# Altium project CustomESP32.PrjPcb
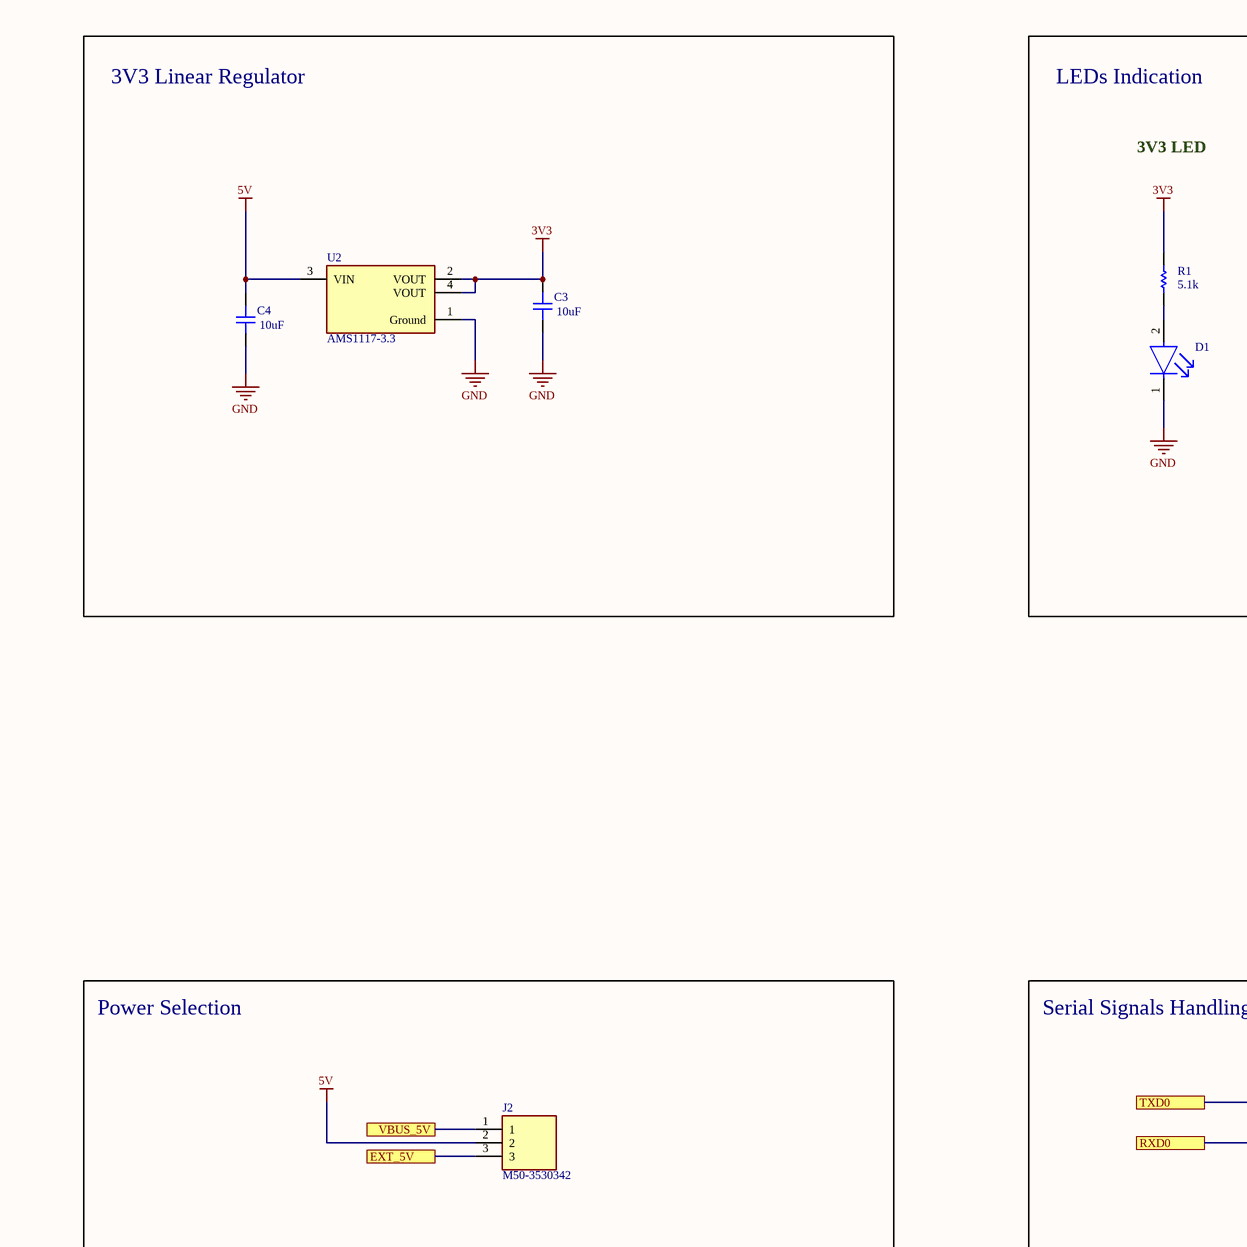
[diagram p0: CustomESP32.SchDoc, top left]
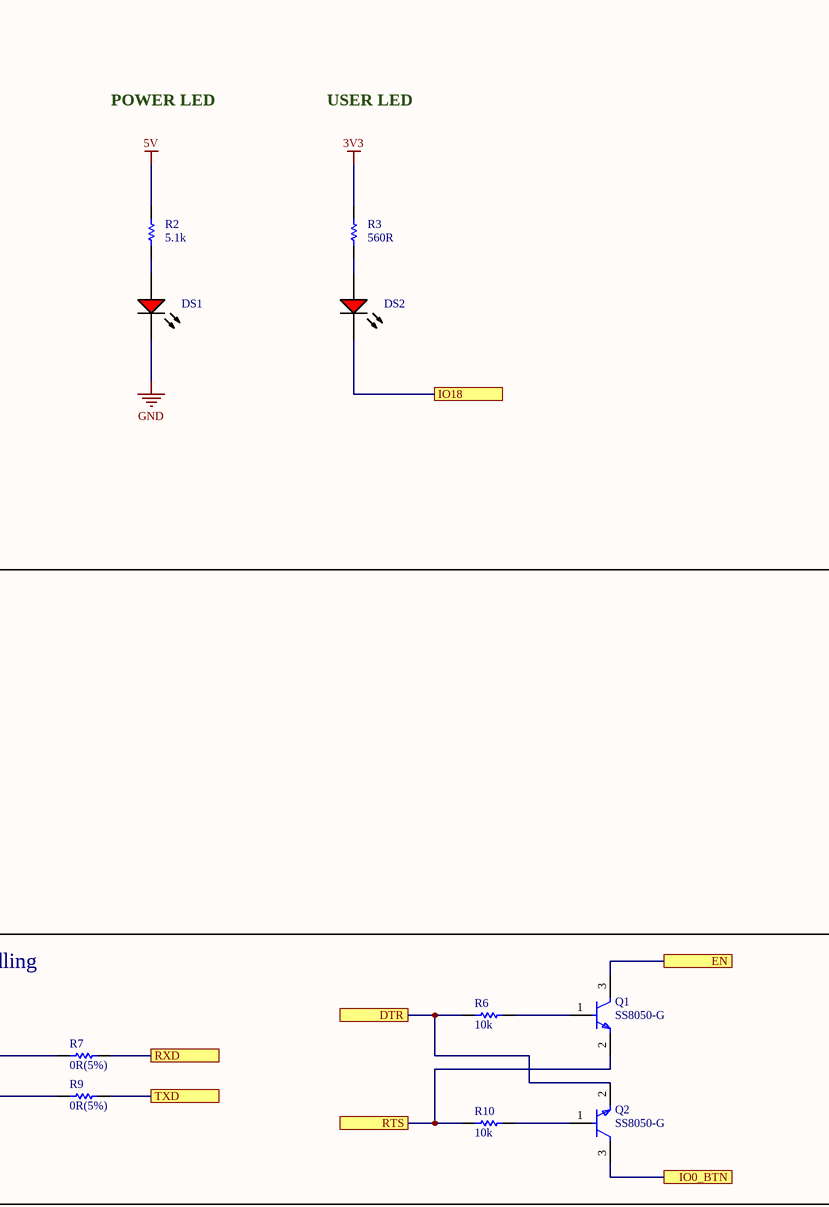
[diagram p1: CustomESP32.SchDoc, top middle]
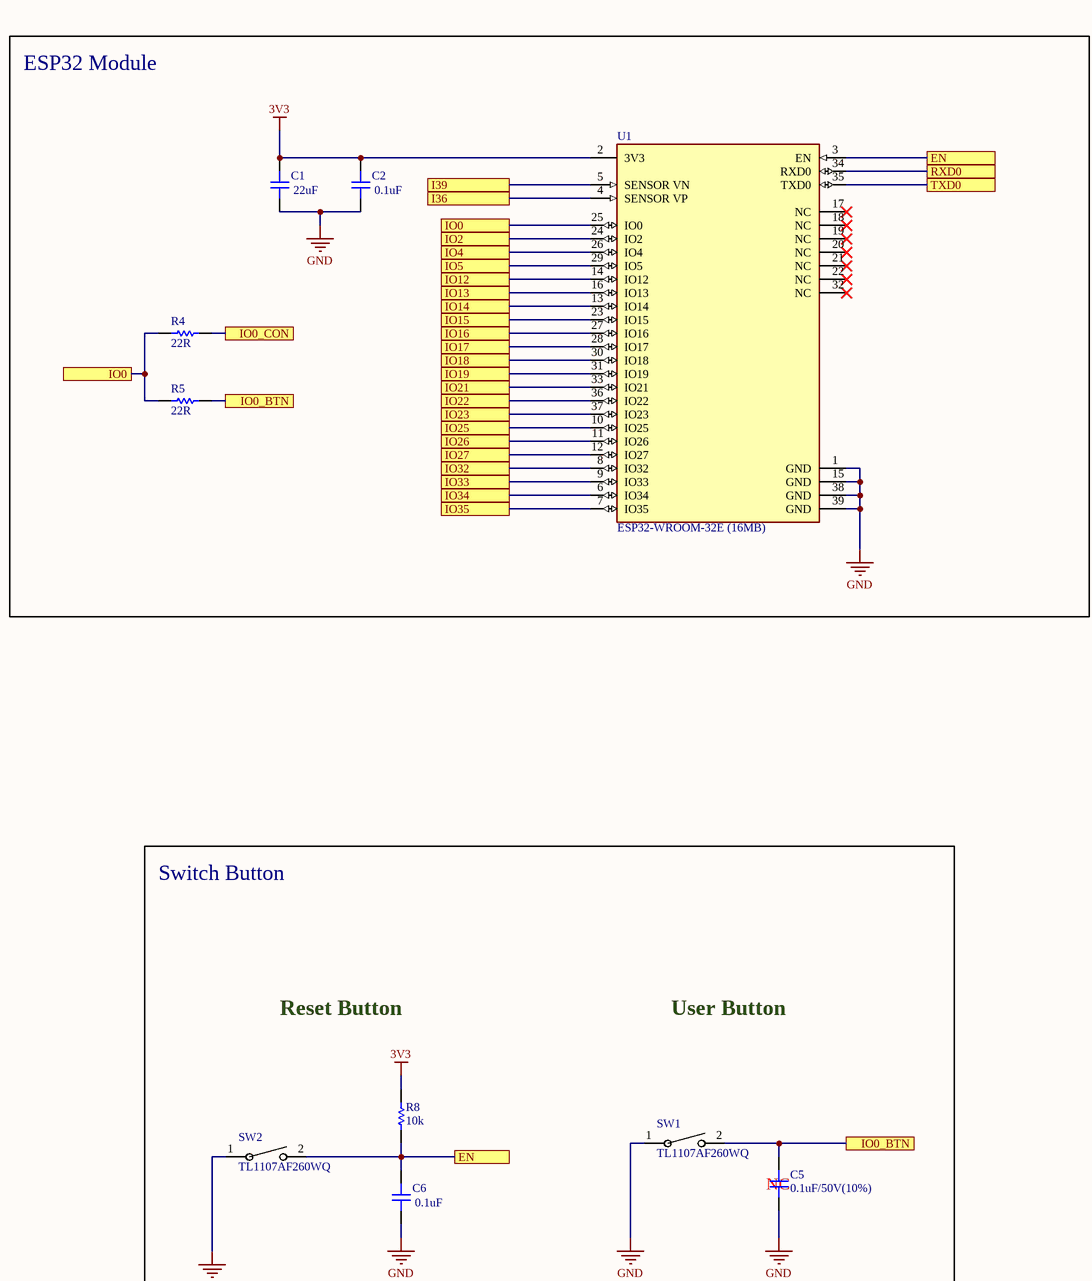
[diagram p2: CustomESP32.SchDoc, top right]
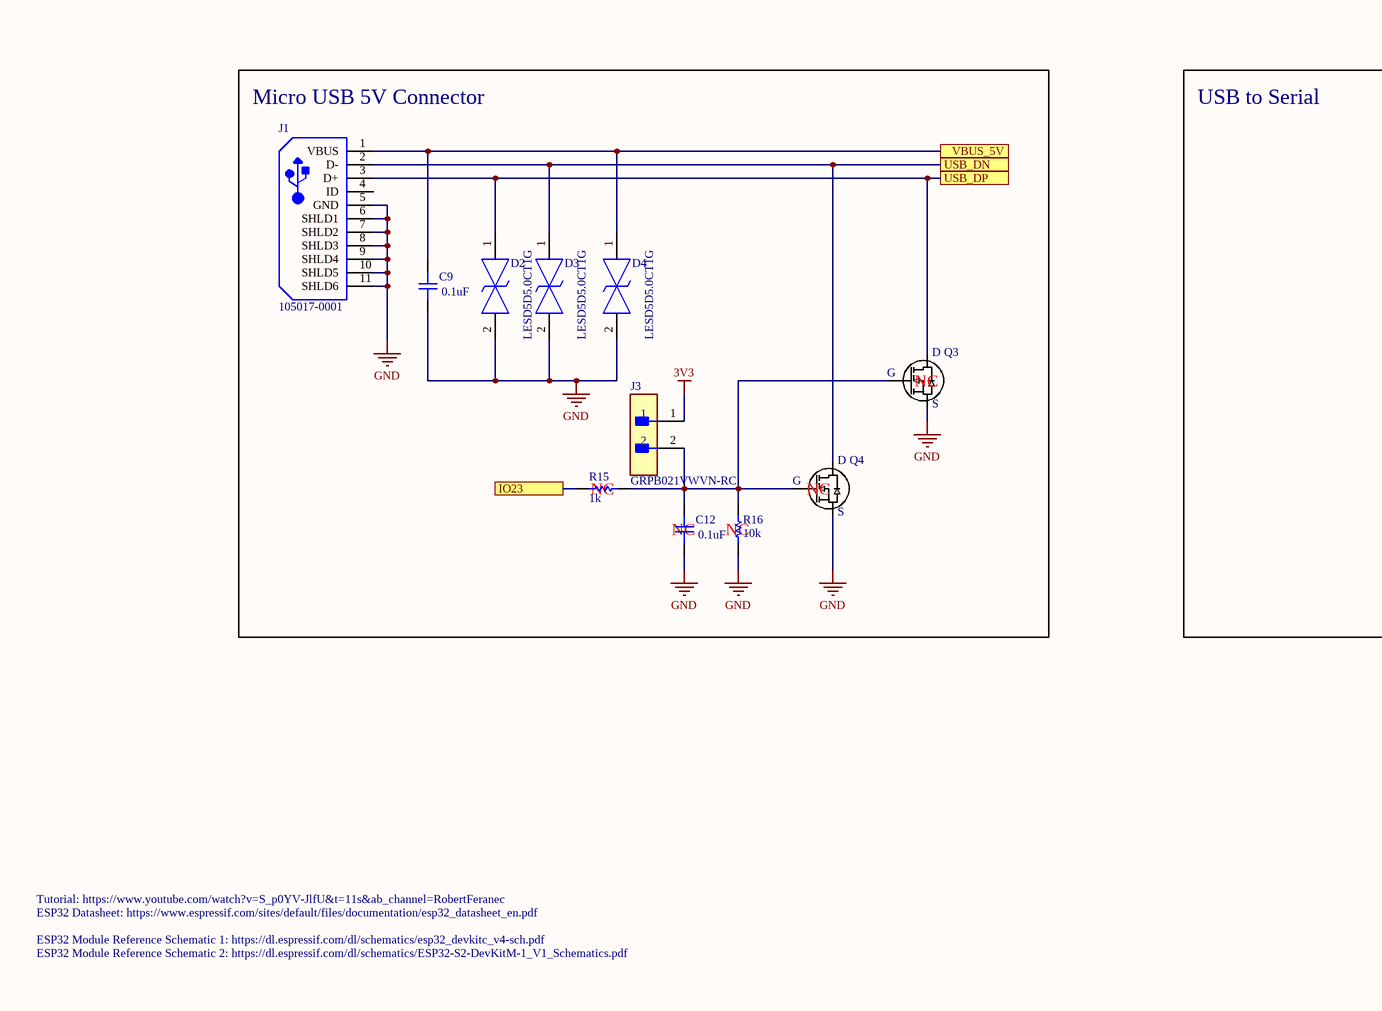
[diagram p3: CustomESP32.SchDoc, bottom left]
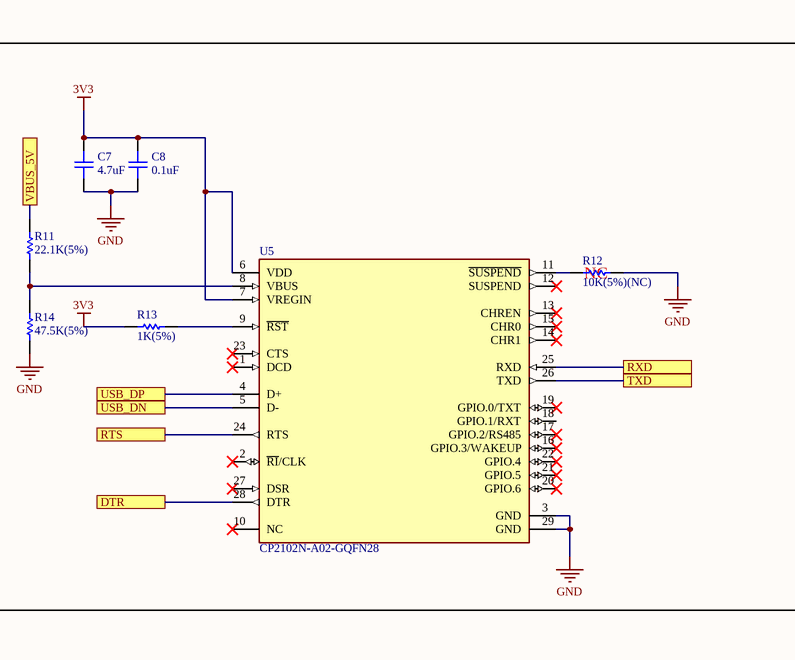
[diagram p4: CustomESP32.SchDoc, bottom middle]
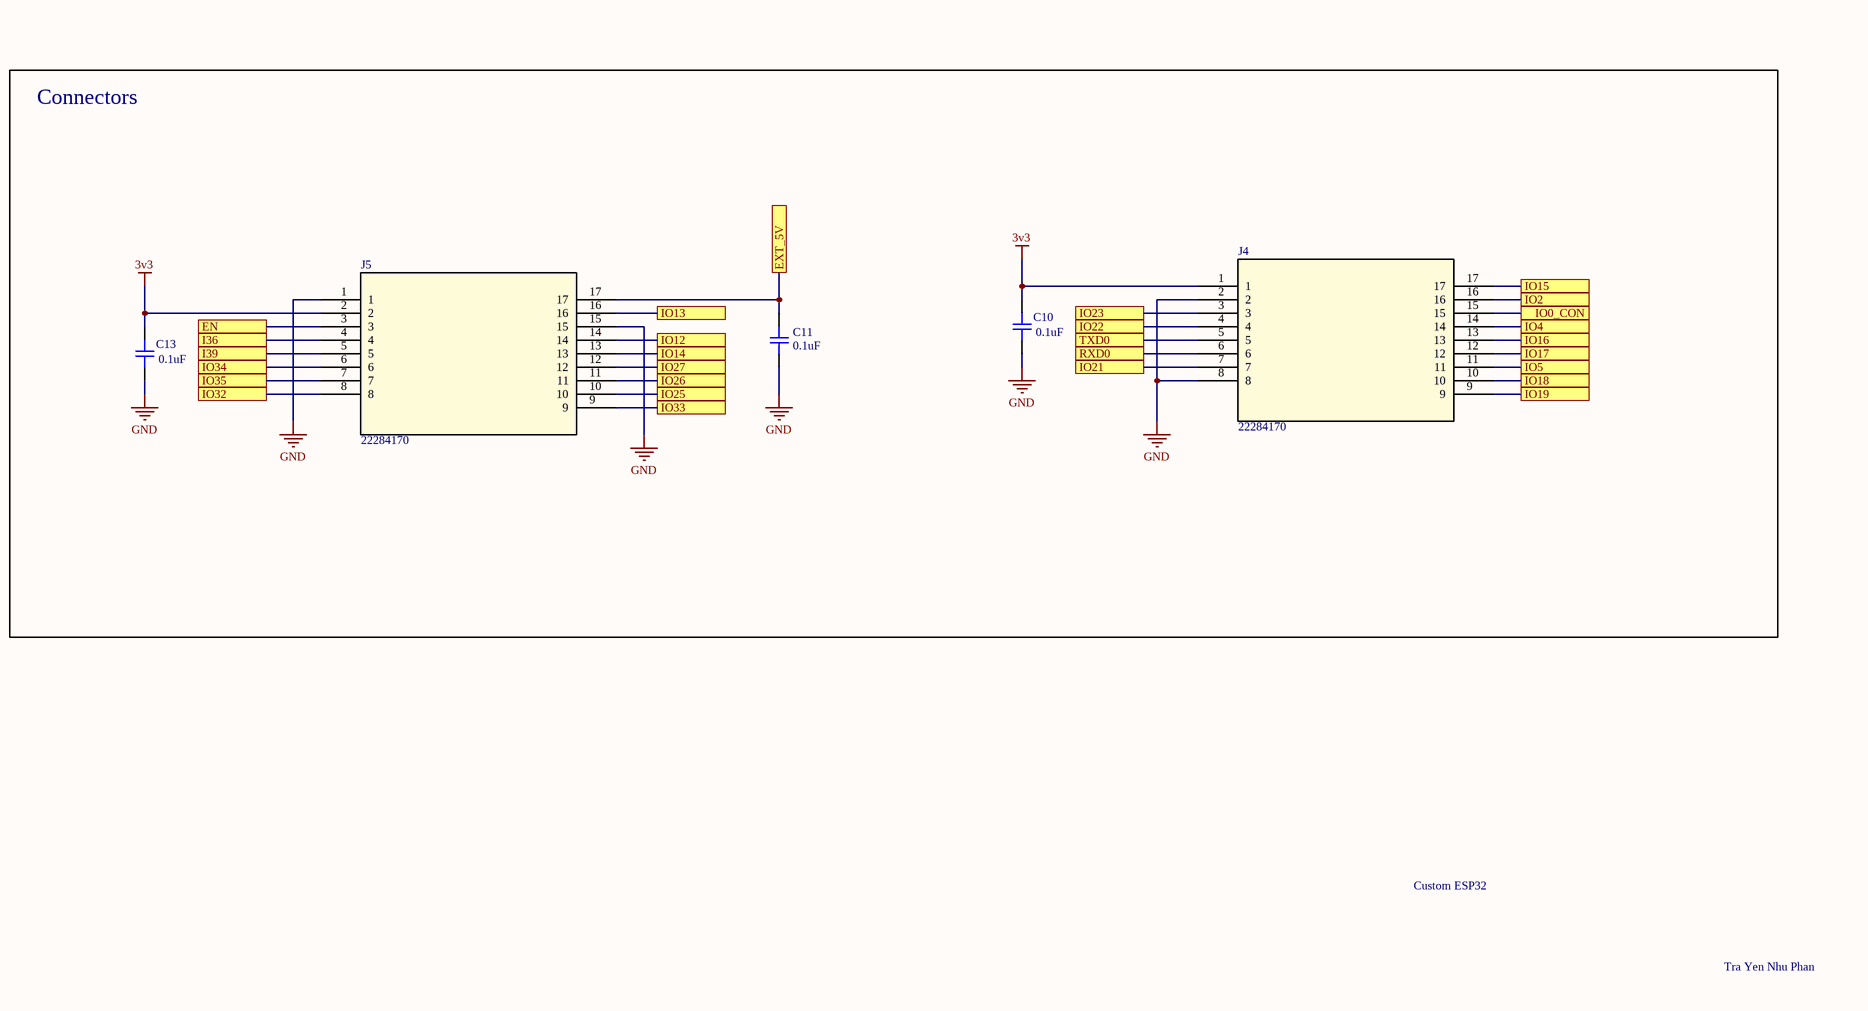
[diagram p5: CustomESP32.SchDoc, bottom right]
1 sheet, 49 parts. Net scope: flat (ports and power ports of the same name join across sheets).
Board file: CustomESP32.PcbDoc

## Sheet CustomESP32.SchDoc
size D; SheetNumber: 1; SheetTotal: 1

### Parts
C1  Capacitance: 22uF  [CAP_0603]  (hidden comment: 22uF/10V(20%))
C2  Capacitance: 0.1uF  [CAP_0603]  (hidden comment: 0.1uF/50V(10%))
C3  Capacitance: 10uF  [CAP_0603]  (hidden comment: 10uF/10V(20%))
C4  Capacitance: 10uF  [CAP_0603]  (hidden comment: 10uF/10V(20%))
C5  0.1uF/50V(10%)  [CAP_0402]
C6  Capacitance: 0.1uF  [CAP_0603]  (hidden comment: 0.1uF/50V(10%))
C7  Capacitance: 4.7uF  [CAP_0402]  (hidden comment: 4.7uF/6.3V(10%))
C8  Capacitance: 0.1uF  [CAP_0402]  (hidden comment: 0.1uF/50V(10%))
C9  Capacitance: 0.1uF  [CAP_0603]  (hidden comment: 0.1uF/50V(10%))
C10  Capacitance: 0.1uF  [CAP_0603]  (hidden comment: 0.1uF/50V(10%))
C11  Capacitance: 0.1uF  [CAP_0402]  (hidden comment: 0.1uF/50V(10%))
C12  Capacitance: 0.1uF  [CAP_0603]  (hidden comment: 0.1uF/50V(10%))
C13  Capacitance: 0.1uF  [CAP_0603]  (hidden comment: 0.1uF/50V(10%))
D1  LTST-C190GKT  [FP-LTST-C190GKT-MFG]  (value not drawn)
D2  LESD5D5.0CT1G  [LESD5D50CT1G]
D3  LESD5D5.0CT1G  [LESD5D50CT1G]
D4  LESD5D5.0CT1G  [LESD5D50CT1G]
DS1  LTST-C170KRKT  [LTST-C170KRKT_V]  (value not drawn)
DS2  LTST-C170KRKT  [LTST-C170KRKT_V]  (value not drawn)
J1  105017-0001  [USB-MICRO-B_V]
J2  M50-3530342  [M50-3530342]
J3  GRPB021VWVN-RC  [FP-GRPB021VWVN-RC-MFG]
J4  22284170  [22284170]
J5  22284170  [22284170]
Q1  SS8050-G  [FP-SS8050-G-MFG]
Q2  SS8050-G  [FP-SS8050-G-MFG]
Q3  2N7002T-7-F  [2N7002T-7-F]  (value not drawn)
Q4  2N7002T-7-F  [2N7002T-7-F]  (value not drawn)
R1  Resistance: 5.1k  [RES_0603]  (hidden comment: R0603)
R2  Resistance: 5.1k  [RES_0603]  (hidden comment: R0603)
R3  Resistance: 560R  [RES_0603]  (hidden comment: R0603)
R4  Resistance: 22R  [RES_0603]  (hidden comment: R0603)
R5  Resistance: 22R  [RES_0603]  (hidden comment: R0603)
R6  Resistance: 10k  [RES_0603]  (hidden comment: 10K(5%))
R7  0R(5%)  [RES_0402]
R8  Resistance: 10k  [RES_0603]  (hidden comment: 10K(5%))
R9  0R(5%)  [RES_0402]
R10  Resistance: 10k  [RES_0603]  (hidden comment: 10K(5%))
R11  22.1K(5%)  [RES_0402]
R12  10K(5%)(NC)  [RES_0402]
R13  1K(5%)  [RES_0402]
R14  47.5K(5%)  [RES_0402]
R15  Resistance: 1k  [RES_0603]  (hidden comment: 1K(5%))
R16  Resistance: 10k  [RES_0603]  (hidden comment: 10K(5%)(NC))
SW1  TL1107AF260WQ  [TL1107AF260WQ]
SW2  TL1107AF260WQ  [TL1107AF260WQ]
U1  ESP32-WROOM-32E (16MB)  [FP-ESP32-WROOM-32E_16MB-MFG]
U2  AMS1117-3.3  [FP-AMS1117-IPC_C]
U5  CP2102N-A02-GQFN28  [FP-CP2102N-A02-GQFN28-MFG]

### Blocks framed on the sheet
3V3 Linear Regulator: C3 C4 U2
LEDs Indication: D1 DS1 DS2 R1-R3
ESP32 Module: C1 C2 R4 R5 U1
Power Selection: J2
Serial Signals Handling: Q1 Q2 R6 R7 R9 R10
Micro USB 5V Connector: C9 C12 D2-D4 J1 J3 Q3 Q4 R15 R16
USB to Serial: C7 C8 R11-R14 U5
Connectors: C10 C11 C13 J4 J5

### Ports
DTR (see CustomESP32[3D]), DTR (see CustomESP32[4B]), EN (see CustomESP32[4B], CustomESP32[5C], CustomESP32[6C]), EN (see CustomESP32[4B], CustomESP32[5C], CustomESP32[7A]), EN (see CustomESP32[4B], CustomESP32[6C], CustomESP32[7A]), EN (see CustomESP32[5C], CustomESP32[6C], CustomESP32[7A]), EXT_5V (see CustomESP32[2C]), EXT_5V (see CustomESP32[6C]), I36 (see CustomESP32[5D]), I36 (see CustomESP32[6A]), I39 (see CustomESP32[5D]), I39 (see CustomESP32[6A]), IO0 (see CustomESP32[5A]), IO0 (see CustomESP32[6A]), IO0_BTN (see CustomESP32[4C], CustomESP32[5A]), IO0_BTN (see CustomESP32[4C], CustomESP32[7C]), IO0_BTN (see CustomESP32[5A], CustomESP32[7C]), IO0_CON (see CustomESP32[5A]), IO0_CON (see CustomESP32[8C]), IO2 (see CustomESP32[6A]), IO2 (see CustomESP32[8C]), IO4 (see CustomESP32[6A]), IO4 (see CustomESP32[8C]), IO5 (see CustomESP32[6A]), IO5 (see CustomESP32[8D]), IO12 (see CustomESP32[6A]), IO12 (see CustomESP32[6D]), IO13 (see CustomESP32[6A]), IO13 (see CustomESP32[6C]), IO14 (see CustomESP32[6A]), IO14 (see CustomESP32[6D]), IO15 (see CustomESP32[6A]), IO15 (see CustomESP32[8C]), IO16 (see CustomESP32[6A]), IO16 (see CustomESP32[8D]), IO17 (see CustomESP32[6A]), IO17 (see CustomESP32[8D]), IO18 (see CustomESP32[4B], CustomESP32[6A]), IO18 (see CustomESP32[4B], CustomESP32[8D]), IO18 (see CustomESP32[6A], CustomESP32[8D]), IO19 (see CustomESP32[6A]), IO19 (see CustomESP32[8D]), IO21 (see CustomESP32[6A]), IO21 (see CustomESP32[7D]), IO22 (see CustomESP32[6A]), IO22 (see CustomESP32[7C]), IO23 (see CustomESP32[1D], CustomESP32[6A]), IO23 (see CustomESP32[1D], CustomESP32[7C]), IO23 (see CustomESP32[6A], CustomESP32[7C]), IO25 (see CustomESP32[6A]), IO25 (see CustomESP32[6D]), IO26 (see CustomESP32[6B]), IO26 (see CustomESP32[6D]), IO27 (see CustomESP32[6B]), IO27 (see CustomESP32[6D]), IO32 (see CustomESP32[5D]), IO32 (see CustomESP32[6B]), IO33 (see CustomESP32[6B]), IO33 (see CustomESP32[6D]), IO34 (see CustomESP32[5D]), IO34 (see CustomESP32[6B]), IO35 (see CustomESP32[5D]), IO35 (see CustomESP32[6B]), RTS (see CustomESP32[3D]), RTS (see CustomESP32[4C]), RXD0 (see CustomESP32[3C], CustomESP32[7A]), RXD0 (see CustomESP32[3C], CustomESP32[7D]), RXD0 (see CustomESP32[7A], CustomESP32[7D]), RXD (see CustomESP32[3B]), RXD (see CustomESP32[4D]), TXD0 (see CustomESP32[3B], CustomESP32[7A]), TXD0 (see CustomESP32[3B], CustomESP32[7D]), TXD0 (see CustomESP32[7A], CustomESP32[7D]), TXD (see CustomESP32[3C]), TXD (see CustomESP32[4D]), USB_DN (see CustomESP32[2C]), USB_DN (see CustomESP32[3D]), USB_DP (see CustomESP32[2C]), USB_DP (see CustomESP32[3D]), VBUS_5V (see CustomESP32[2C]), VBUS_5V (see CustomESP32[2C], CustomESP32[3C])

### Nets
3V3: C1.2 C2.2 C3.2 C7.2 C8.2 C10.2 C13.2 J3.1 J4.1 J5.2 R1.2 R3.2 R8.1 R13.1 U1.2(3V3) U2.2(VOUT) U2.4(VOUT) U5.6(VDD) U5.7(VREGIN)
5V: C4.2 J2.2 R2.2 U2.3(VIN)
GND: C1.1 C2.1 C3.1 C4.1 C5.1 C6.1 C7.1 C8.1 C9.1 C10.1 C11.1 C12.1 C13.1 D1.1(C) D2.2 D3.2 D4.2 DS1.2(K) J1.5(GND) J1.6(SHLD1) J1.7(SHLD2) J1.8(SHLD3) J1.9(SHLD4) J1.10(SHLD5) J1.11(SHLD6) J4.2 J4.8 J5.1 J5.15 Q3.2(S) Q4.2(S) R12.2 R14.1 R16.1 SW1.1 SW2.1 U1.1(GND) U1.15(GND) U1.38(GND) U1.39(GND) U2.1(Ground) U5.3(GND) U5.29(GND)
NetC5_2: C5.2 Q2.3(C) R5.1 SW1.2 ; port IO0_BTN
NetC6_2: C6.2 J5.3 Q1.3(C) R8.2 SW2.2 U1.3(EN) ; port EN
NetC9_2: C9.2 D4.1 J1.1(VBUS) J2.1 R11.2 ; port VBUS_5V
NetC11_2: C11.2 J2.3 J5.17 ; port EXT_5V
NetC12_2: C12.2 J3.2 Q3.1(G) Q4.1(G) R15.1 R16.2
NetD1_2: D1.2(A) R1.1
NetD2_1: D2.1 J1.3(D+) Q3.3(D) U5.4(D+) ; port USB_DP
NetD3_1: D3.1 J1.2(D-) Q4.3(D) U5.5(D-) ; port USB_DN
NetDS1_1: DS1.1(A) R2.1
NetDS2_1: DS2.1(A) R3.1
NetDS2_2: DS2.2(K) J4.10 U1.30(IO18) ; port IO18
NetJ4_3: J4.3 R15.2 U1.37(IO23) ; port IO23
NetJ4_4: J4.4 U1.36(IO22) ; port IO22
NetJ4_5: J4.5 R7.1 U1.35(TXD0) ; port TXD0
NetJ4_6: J4.6 R9.1 U1.34(RXD0) ; port RXD0
NetJ4_7: J4.7 U1.33(IO21) ; port IO21
NetJ4_9: J4.9 U1.31(IO19) ; port IO19
NetJ4_11: J4.11 U1.29(IO5) ; port IO5
NetJ4_12: J4.12 U1.28(IO17) ; port IO17
NetJ4_13: J4.13 U1.27(IO16) ; port IO16
NetJ4_14: J4.14 U1.26(IO4) ; port IO4
NetJ4_15: J4.15 R4.1 ; port IO0_CON
NetJ4_16: J4.16 U1.24(IO2) ; port IO2
NetJ4_17: J4.17 U1.23(IO15) ; port IO15
NetJ5_4: J5.4 U1.4(SENSOR_VP) ; port I36
NetJ5_5: J5.5 U1.5(SENSOR_VN) ; port I39
NetJ5_6: J5.6 U1.6(IO34) ; port IO34
NetJ5_7: J5.7 U1.7(IO35) ; port IO35
NetJ5_8: J5.8 U1.8(IO32) ; port IO32
NetJ5_9: J5.9 U1.9(IO33) ; port IO33
NetJ5_10: J5.10 U1.10(IO25) ; port IO25
NetJ5_11: J5.11 U1.11(IO26) ; port IO26
NetJ5_12: J5.12 U1.12(IO27) ; port IO27
NetJ5_13: J5.13 U1.13(IO14) ; port IO14
NetJ5_14: J5.14 U1.14(IO12) ; port IO12
NetJ5_16: J5.16 U1.16(IO13) ; port IO13
NetQ1_1: Q1.1(B) R6.2
NetQ1_2: Q1.2(E) R10.1 U5.24(RTS) ; port RTS
NetQ2_1: Q2.1(B) R10.2
NetQ2_2: Q2.2(E) R6.1 U5.28(DTR) ; port DTR
NetR4_2: R4.2 R5.2 U1.25(IO0) ; port IO0
NetR7_2: R7.2 U5.25(RXD) ; port RXD
NetR9_2: R9.2 U5.26(TXD) ; port TXD
NetR11_1: R11.1 R14.2 U5.8(VBUS)
NetR12_1: R12.1 U5.11(~{SUSPEND})
NetR13_2: R13.2 U5.9(~{RST})

Not connected (* = marked no-connect by the designer): J1 4(ID); U1 17(NC)* 18(NC)* 19(NC)* 20(NC)* 21(NC)* 22(NC)* 32(NC)*; U5 1(DCD)* 2(~{RI}/CLK)* 10(NC)* 12(SUSPEND)* 13(CHREN)* 14(CHR1)* 15(CHR0)* 16(GPIO.3/WAKEUP)* 17(GPIO.2/RS485)* 18(GPIO.1/RXT) 19(GPIO.0/TXT)* 20(GPIO.6)* 21(GPIO.5)* 22(GPIO.4)* 23(CTS)* 27(DSR)*

### Notes on the sheet
- 3V3 LED
- POWER LED
- USER LED
- Switch Button
- Reset Button
- User Button
- (near C5) NC
- (near R12) NC
- (near Q3) NC
- (near R15) NC
- (near Q4) NC
- (near C12) NC
- (near R16) NC
- Tutorial: https://www.youtube.com/watch?v=S_p0YV-JlfU&t=11s&ab_channel=RobertFeranec
- Custom ESP32
- ESP32 Datasheet: https://www.espressif.com/sites/default/files/documentation/esp32_datasheet_en.pdf
- ESP32 Module Reference Schematic 2: https://dl.espressif.com/dl/schematics/ESP32-S2-DevKitM-1_V1_Schematics.pdf
- ESP32 Module Reference Schematic 1: https://dl.espressif.com/dl/schematics/esp32_devkitc_v4-sch.pdf
- Tra Yen Nhu Phan

### Library data of the parts
C1-C4 C6 C9 C10 C12 C13 = CAP_0603_50V: Capacitor SMD 0603 50V
C5 C8 C11 = CAP_0402_50V: Capacitor SMD 0402 50V
C7 = CAP_0402_6V3: Capacitor SMD 0402 6V3
D1 = CMP-22017-000005-2: LED GREEN CLEAR CHIP SMD; Dominant Wavelength: 569nm; Reverse Voltage: 5V; Lens Color: Colorless; Viewing Angle: 130°; Voltage: 2V; Forward Current: 30mA; Power Dissipation: 100mW; Luminous Intensity: 6mcd; Number of LEDs: 1; Forward Voltage: 2.1V; Wavelength: 565nm; Test Current: 10mA; Min Operating Temperature: -55°C; Lens Style: Clear; Mount: Surface Mount; Width: 0.8mm; Packaging: Tape and Reel; Lens Transparency: Clear; Case Code (Metric): 1608; Depth: 0.8mm; Case Code (Imperial): 0603; Case/Package: 0603; Number of Pins: 2; Max Operating Temperature: 85°C; Lead Free: Lead Free; Number of Elements: 1; Length: 1.6mm; Height: 0.8mm; Package Quantity: 1; Power Rating: 100mW; Radiation Hardening: No; Illumination Color: Green; Color: Green
D2-D4 = LESD5D5.0CT1G: TVS Diode (Bi-directional); Manufacturer_Name: LRC; Height: 0.7mm; Manufacturer_Part_Number: LESD5D5.0CT1G
DS1 DS2 = CMP-2000-07593-1: LED Red, 75 mW, 54 mcd, -55 to 85 degC, 2-Pin SMD, RoHS, Tape and Reel; Manufacturer: Lite-On; Lens Transparency: Clear; Number of Elements: 1; Power Rating: 75mW; Luminous Intensity: 54mcd; Viewing Angle: 130degrees; Forward Current: 30mA; Wavelength: 639nm; Lens Style: Rectangular; Case\/Package: 0805; Test Current: 20mA; Dominant Wavelength: 631nm; Forward Voltage: 2V; Lens Colour: Colorless; Min Operating Temperature: -55degC; RoHSCompliant: True; Length: 3.2mm; Width: 1.25mm; Mount: SurfaceMount; Packaging: TapeandReel; Number of LEDs: 1; Radiation Hardening: No; Datasheet URL: http://optoelectronics.liteon.com/upload/download/DS-22-99-0150/LTST-C170KRKT.pdf; Datasheet Version: Rev. D, 11/2014; Case Code (Metric): 2012; Height: 1.1mm; Number of Pins: 2; Package Description: 2-Pin Surface Mount Device, Body 2 x 1.25 mm; Manufacturer URL: http://www.us.liteon.com/; Lead Free: LeadFree; Illumination Colour: Red; Colour: Red; Case Code (Imperial): 0805; Max Operating Temperature: 85degC; Power Dissipation: 75mW; Mounting Technology: SurfaceMount; Package Reference: C170KRKT; Package Quantity: 1; Depth: 1.6mm
J1 = CMP-2000-05827-1: Micro-USB B Receptacle, Right Angle, Bottom Mount, Surface Mount, with Solder Tabs, -30 to 85 degC, 5-Pin USB, RoHS, Tape and Reel; Manufacturer: Molex; Featured Product: Micro-USBConnectorsUSBConnectors; Other Names: WM1399DKR; Package Version: Rev. F, 12/2012; Number of Contacts: 5; Connector Type: USB-microB; Catalog Drawings: 1050170001; 3D Model: 105017-0001.stp; Mating Products: WM17145-ND-CABLEMICROUSBBTOSTDA1.0MWM17147-ND-CABLEMICROUSBBTOSTDA2.0MWM17146-ND-CABLEMICROUSBBTOSTDA1.5M; PCN Assembly/Origin: ResinSupplier21/Oct/2015; Voltage - Max: 30V; Online Catalog: Molex-MicroUSB; Manufacturer URL: http://www.molex.com/; Package Description: 5-Leads USB, Micro B, Body 7.5 x 5 mm, Pitch 0.65 mm; Datasheet URL: http://www.molex.com/elqNow/elqRedir.htm?ref=http://www.molex.com/webdocs/datasheets/pdf/en-us/1050170001_IO_CONNECTORS.pdf; Ingress Protection: -; Datasheet Version: 03/2016; Mounting Type: BoardCutout,SurfaceMount,RightAngle; Circuits: 5; Standard Package: 1; Package Reference: MICRO-B; Package URL: http://www.molex.com/pdm_docs/sd/1050170001_sd.pdf; Category: Connectors,Interconnects; Series: -; RoHS Information: 1050170001CertofCompliance; Features: Shielded,SolderRetention; Family: USB,DVI,HDMIConnectors; Specifications: -; Gender: Receptacle; Packaging: Digi-Reel®; Mounting Technology: SurfaceMount
J2 = M50-3530342: Connector; Manufacturer_Name: Harwin; Datasheet Link: https://cdn.harwin.com/pdfs/M50-353.pdf; Height: 4.3mm; Manufacturer_Part_Number: M50-3530342; Mouser Part Number: 855-M50-3530342; Mouser Price/Stock: https://www.mouser.co.uk/ProductDetail/Harwin/M50-3530342?qs=%252BdQmOuGyFcFOxjGK%2F4HnAg%3D%3D
J3 = CMP-2000-06371-2: CONN HEADER VERT 2POS 1.27MM; Number of Positions: 2; Connector Type: Male Pin; Pitch: 0.05inch; Contact Plating: Gold; Lead Free: Lead Free; Termination: Solder; Packaging: Bulk; RoHS Compliant: Yes; Contact Type: Male Pin; Mount: Through Hole; Number of Rows: 1; Contact Mating Length: 0.118inch; Package Quantity: 1
J4 J5 = 22284170: No Description Available; Mfr_Name: Molex Connector Corporation; RefDes: RefDes; Type: Type
Q1 Q2 = CMP-20235-000001-1: NPN TRANSISTOR 1.5A 40V SOT-23 R; Transition Frequency: 100MHz; Max Breakdown Voltage: 25V; Collector Emitter Voltage (VCEO): 400mV; Max Power Dissipation: 300mW; Max Collector Current: 1.5A; Case/Package: TO-236-3; Packaging: Tape and Reel; RoHS Compliant: Yes; Mount: Surface Mount; Collector Emitter Breakdown Voltage: 25V
Q3 Q4 = 2N7002T-7-F: Small Signal Field-Effect Transistor, 0.115A I(D), 60V, 1-Element, N-Channel, Silicon, Metal-oxide Semiconductor FET; Manufacturer: ON Semiconductor / Fairchild; Manufacturer Part Number: FDN340P; Package Body Material: Plastic; Polarity/Channel Type: P-CHANNEL; Drain Current-Max (Abs) (ID): 2A; Drain-source On Resistance-Max: 70R; DS Breakdown Voltage-Min: 20V; Number of Elements: 1; Operating Mode: ENHANCEMENT MODE; Power Dissipation-Max (Abs): 500mW; Transistor Application: SWITCHING; Qualification Status: Not Qualified; Additional Feature: HIGH RELIABILITY; Feedback Cap-Max (Crss): 5pF; Time @ Peak Reflow Temperature-Max (s): 40s; Supplier 1: Arrow Electronics; RoHS: Yes; Category: MOSFETs; Stock 1: 946; Pricing 1: 1=0.1191, 10=0.1173, 25=0.1155, 100=0.1137, 250=0.112, 500=0.1102, 1000=0.1084, 3000=0.1066, 6000=0.1048 (USD); Pins: 3; Package Shape: Rectangular; Transistor Element Material: SILICON; Terminal Finish: Tin; Max Operating Temperature: 150°C; Drain Current-Max (ID): 2A; FET Technology: METAL-OXIDE SEMICONDUCTOR; JESD-30 Code: R-PDSO-G3; Moisture Sensitivity Level: 1; Package Style: SMALL OUTLINEMeter; Surface Mount: Yes; Terminal Form: Gull Wing; Terminal Position: DUAL; JESD-609 Code: e3; Reach SVHC Compliant: Yes; RoHS Compliant: Yes; ComponentLink1URL: https://datasheet.ciiva.com:443/pdfs/VipMasterIC/IC/ONSM/ONSM-S-A0003584711/ONSM-S-A0003584686-1.pdf?src-supplier=IHS+Markit; ComponentLink1Description: https://datasheet.ciiva.com:443/pdfs/VipMasterIC/IC/ONSM/ONSM-S-A0003584711/ONSM-S-A0003584686-1.pdf?src-supplier=IHS+Markit; ComponentLink2URL: https://datasheet.ciiva.com/7968/276210-7968140.pdf?src-supplier=Element14; ComponentLink2Description: https://datasheet.ciiva.com/7968/276210-7968140.pdf?src-supplier=Element14; ComponentLink3URL: https://datasheet.ciiva.com/28548/276210-28548189.pdf?src-supplier=Element14; ComponentLink3Description: https://datasheet.ciiva.com/28548/276210-28548189.pdf?src-supplier=Element14; Supplier 2: Future Electronics; Stock 2: 396000; Pricing 2: 3000=0.0523, 9000=0.0503, 15000=0.0494, 45000=0.0476, 75000=0.046 (USD); Peak Reflow Temperature (Cel): 260°C; ComponentLink4URL: https://datasheet.ciiva.com:443/pdfs/VipMasterIC/IC/DIOD/DIOD-S-A0009691157/DIOD-S-A0009831364-1.pdf?src-supplier=IHS+Markit; ComponentLink4Description: https://datasheet.ciiva.com:443/pdfs/VipMasterIC/IC/DIOD/DIOD-S-A0009691157/DIOD-S-A0009831364-1.pdf?src-supplier=IHS+Markit; ComponentLink5URL: https://datasheet.ciiva.com/34302/1538460-34302350.pdf?src-supplier=Jameco; ComponentLink5Description: https://datasheet.ciiva.com/34302/1538460-34302350.pdf?src-supplier=Jameco; ComponentLink6URL: https://datasheet.ciiva.com/3304/ds30301-3304394.pdf?src-supplier=Avnet; ComponentLink6Description: https://datasheet.ciiva.com/3304/ds30301-3304394.pdf?src-supplier=Avnet; ComponentLink7URL: https://datasheet.ciiva.com/17103/2n7002t-7-f-17103286.pdf?src-supplier=Allied+Electronics; ComponentLink7Description: https://datasheet.ciiva.com/17103/2n7002t-7-f-17103286.pdf?src-supplier=Allied+Electronics; ComponentLink8URL: https://datasheet.ciiva.com/1188/ds30301-1188477.pdf?src-supplier=Element14; ComponentLink8Description: https://datasheet.ciiva.com/1188/ds30301-1188477.pdf?src-supplier=Element14; ComponentLink9URL: https://datasheet.ciiva.com/22712/1915455-22712378.pdf?src-supplier=Element14; ComponentLink9Description: https://datasheet.ciiva.com/22712/1915455-22712378.pdf?src-supplier=Element14; ComponentLink10URL: https://datasheet.ciiva.com/3304/ds30301-3304395.pdf?src-supplier=Avnet; ComponentLink10Description: https://datasheet.ciiva.com/3304/ds30301-3304395.pdf?src-supplier=Avnet; ComponentLink11URL: https://datasheet.ciiva.com/16287/ds30301-16287372.pdf?src-supplier=Future+Electronics; ComponentLink11Description: https://datasheet.ciiva.com/16287/ds30301-16287372.pdf?src-supplier=Future+Electronics; ComponentLink12URL: https://datasheet.ciiva.com/15219/getdatasheetpartid-141065-15219671.pdf?src-supplier=Verical; ComponentLink12Description: https://datasheet.ciiva.com/15219/getdatasheetpartid-141065-15219671.pdf?src-supplier=Verical; ComponentLink13URL: https://datasheet.ciiva.com/934/ds30301-934600.pdf?src-supplier=Digi-Key; ComponentLink13Description: https://datasheet.ciiva.com/934/ds30301-934600.pdf?src-supplier=Digi-Key; ComponentLink14URL: https://datasheet.ciiva.com/934/ds30301-934601.pdf?src-supplier=Digi-Key; ComponentLink14Description: https://datasheet.ciiva.com/934/ds30301-934601.pdf?src-supplier=Digi-Key; ComponentLink15URL: https://datasheet.ciiva.com/934/ds30301-934599.pdf?src-supplier=Digi-Key; ComponentLink15Description: https://datasheet.ciiva.com/934/ds30301-934599.pdf?src-supplier=Digi-Key; Supplier Part Number 1: FDN340P; Supplier Part Number 2: 6857122
R1-R6 R8 R10 R15 R16 = RES_0603: Resistor SMD 0603; Manufacturer: *; Manufacturer Part Number: *; Distributor Link: *
R7 R9 R11-R14 = RES_0402: Resistor SMD 0402; Manufacturer: *; Manufacturer Part Number: *; Distributor Link: *
SW1 SW2 = TL1107AF260WQ: No Description Available; Mfr_Name: E-Switch
U1 = CMP-194065-000027-1: RX TXRX MOD WIFI TRACE ANT SMD
U2 = CMP-209535-000001-1: LDO Voltage Regulators 1A, 3.3V; Manufacturer: Advanced Monolithic Systems; Dropout Voltage: 1.1V; Output Type: Fixed; Nominal Supply Current: 5mA; Max Power Dissipation: 1.2W; Max Supply Voltage: 15V; Number Of Outputs: 1; Standoff Height: 0.64mm; Max Junction Temp: +125°C; Height: 1.8mm; Package: AMS1117; Device Class L2: Power Management ICs; ComponentLink2Description: Datasheet; ComponentLink2URL: http://www.advanced-monolithic.com/pdf/ds1117.pdf; Category: IC; RoHS: TRUE; Automotive: No; Device Class L1: Integrated Circuits (ICs); Output Current: 1A; Device Class L3: Voltage Regulators - Linear; Temperature: -40°C to +125°C; Output Voltage: 3.3V; Manufacturer Part Number: AMS1117-3.3; Temperature Range Low: -40°C; Octopart: https://octopart.com/ams1117-3.3-advanced+monolithic+systems-25899300; Lead Free: Yes; Ipc Land Pattern Name: SOT229P700X180-4; Temperature Range High: +125°C
U5 = CMP-08093-000005-1: IC USB TO UART BRIDGE QFN28